# Altium schematic sheet Power.SchDoc
size A
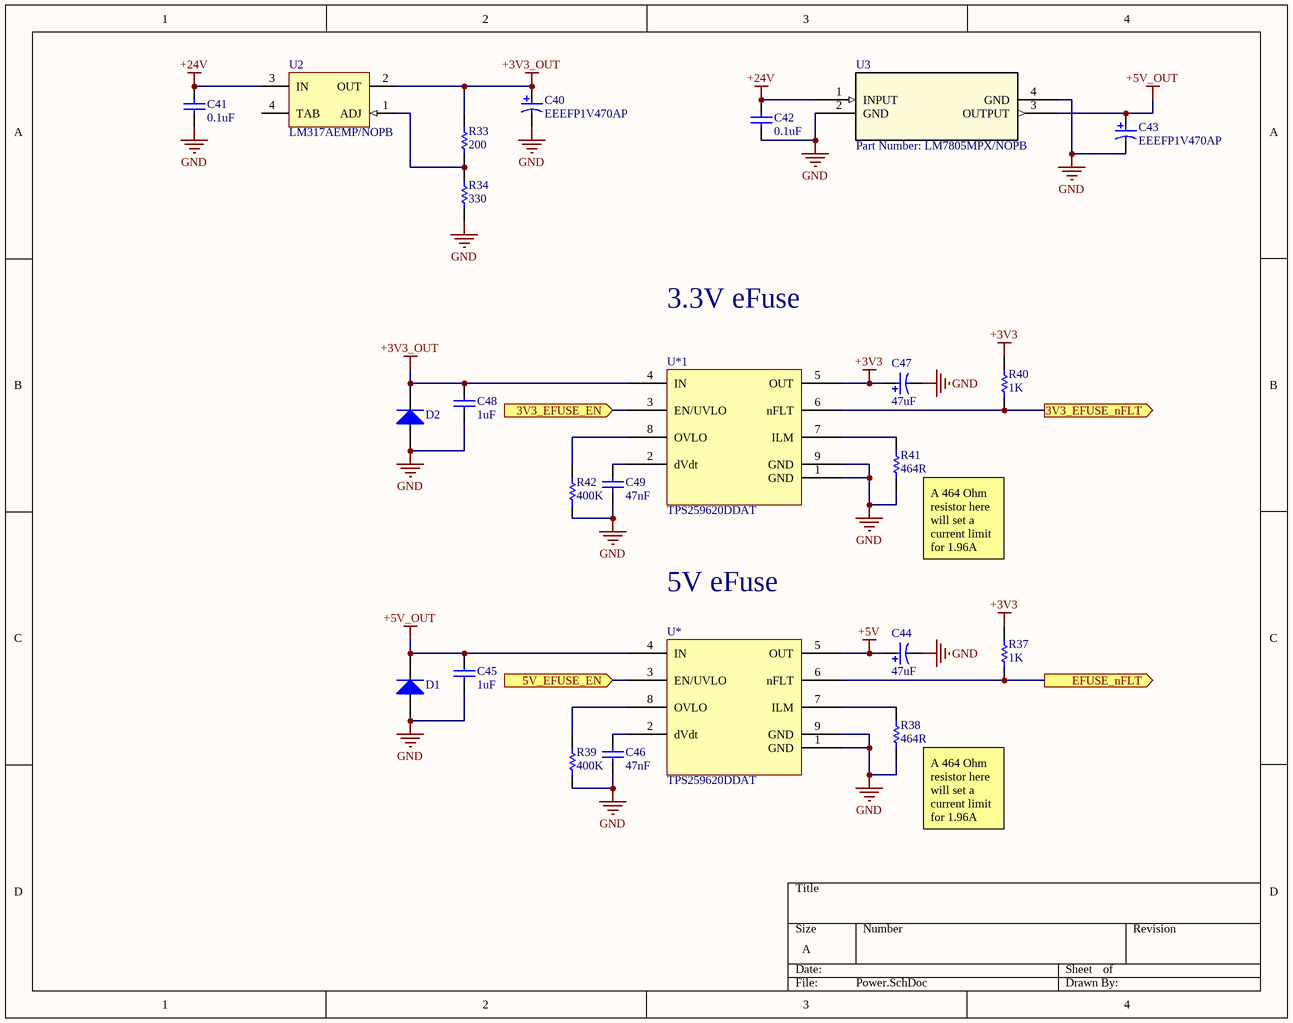
[diagram p0: Power.SchDoc]

## Parts
C40  EEEFP1V470AP  [PNSC-FP-V-D_V]
C41  0.1uF  [CAPC1608X90X35ML10T15]
C42  0.1uF  [CAPC1608X90X35ML10T15]
C43  EEEFP1V470AP  [PNSC-FP-V-D_V]
C44  47uF  [PNSC-FP-V-D_V]
C45  1uF  [CAPC1608X90X20LL10]
C46  47nF  [CAPC1608X90X35ML10T15]
C47  47uF  [PNSC-FP-V-D_V]
C48  1uF  [CAPC1608X90X20LL10]
C49  47nF  [CAPC1608X90X35ML10T15]
D1  SMAJ5.0A-E3/61  [VISH-DO-214AC-2_M]  (value not drawn)
D2  SMAJ5.0A-E3/61  [VISH-DO-214AC-2_M]  (value not drawn)
R33  200  [RESC1608X55X30NL20T20]
R34  330  [RESC1608X55X30NL15T15]
R37  1K  [RESC1608X55X30LL15T15]
R38  464R  [RESC1608X55X30LL15T15]
R39  400K  [RESC1608X55X30LL15T15]
R40  1K  [RESC1608X55X30LL15T15]
R41  464R  [RESC1608X55X30LL15T15]
R42  400K  [RESC1608X55X30LL15T15]
U2  LM317AEMP/NOPB  [DCY0004A_L]
U3  Part Number: LM7805MPX/NOPB  [DCY4]
U*  TPS259620DDAT
U*1  TPS259620DDAT

## Ports
3V3_EFUSE_EN (in), 3V3_EFUSE_nFLT (out), 5V_EFUSE_EN (in), EFUSE_nFLT (out)

## Nets
+3V3: C47.1 R37.2 R40.2 U*1.5(OUT)
+3V3_OUT: C40.1 C48.2 D2.1(K) R33.2 U2.2(OUT) U*1.4(IN)
+5V: C44.1 U*.5(OUT)
+5V_OUT: C43.1 C45.2 D1.1(K) U3.3(OUTPUT) U*.4(IN)
+24V: C41.2 C42.2 U2.3(IN) U3.1(INPUT)
GND: C40.2 C41.1 C42.1 C43.2 C44.2 C45.1 C46.1 C47.2 C48.1 C49.1 D1.2(A) D2.2(A) R34.1 R38.1 R39.1 R41.1 R42.1 U3.2(GND) U3.4(GND) U*.1(GND) U*.9(GND) U*1.1(GND) U*1.9(GND)
3V3_EFUSE_EN: U*1.3(EN/UVLO) ; port 3V3_EFUSE_EN
3V3_EFUSE_nFLT: R40.1 U*1.6(nFLT) ; port 3V3_EFUSE_nFLT
5V_EFUSE_EN: U*.3(EN/UVLO) ; port 5V_EFUSE_EN
EFUSE_nFLT: R37.1 U*.6(nFLT) ; port EFUSE_nFLT
NetC46_2: C46.2 U*.2(dVdt)
NetC49_2: C49.2 U*1.2(dVdt)
NetR33_1: R33.1 R34.2 U2.1(ADJ)
NetR38_2: R38.2 U*.7(ILM)
NetR39_2: R39.2 U*.8(OVLO)
NetR41_2: R41.2 U*1.7(ILM)
NetR42_2: R42.2 U*1.8(OVLO)

Not connected (* = marked no-connect by the designer): U2 4(TAB)

## Notes on the sheet
- 3.3V eFuse
- (near R41) A 464 Ohm resistor here will set a current limit for 1.96A
- 5V eFuse
- (near R38) A 464 Ohm resistor here will set a current limit for 1.96A

## Library data of the parts
C40 C43 C44 C47 = CMP-2000-06216-1: Aluminum Electrolytic Capacitor, 47 uF, +/- 20%, 35 V, 2-Pin SMD (Size Code D), -55 to 105 degC, RoHS, Tape and Reel; Manufacturer: Panasonic; Lifetime@Temperature: 2000Hrs@105°C; Capacitance: 47µF; Type: Can; Rated Voltage: 35V; Ripple Current: 300mA; ESR (Equivalent Series Resistance): 0.26O; Package Reference: FP-V-D; Package Description: 2-Pin Electrolytic Aluminum Capacitor, Body 6.6 x 6.6 mm; Datasheet URL: http://industrial.panasonic.com/cdbs/www-data/pdf/RDE0000/ABA0000C1184.pdf; Series: FP; Operating Temp Range: -55to+105°C; Operating Temp-Max: 105°C; Datasheet Version: 03/2016; Manufacturer URL: http://www.panasonic.com/; Package URL: http://industrial.panasonic.com/cdbs/www-data/pdf/RDE0000/DME0000COL48.pdf; Case Size/Dimension: Ø6.3x5.8mm; Mounting Technology: SurfaceMount
C41 C42 = CMP-2100-03643-1: Chip Capacitor, 0.1 uF, +/- 10%, 50 V, -55 to 125 degC, 0603 (1608 Metric), RoHS, Tape and Reel; Manufacturer: Murata; Dielectric Material: Ceramic; Voltage Rating: 50V; Capacitance: 100nF; Dielectric: X7R; Insulation Resistance: 10GR; Case Code (Metric): 1608; Lead Free: LeadFree; Depth: 0.8mm; Number of Pins: 2; Radiation Hardening: No; Case/Package: 0603; Manufacturer URL: http://www.murata.com/; Packaging: TapeandReel; Length: 1.6mm; Contact Plating: Tin; Datasheet URL: http://psearch.en.murata.com/capacitor/product/GRM188R71H104KA93%23.pdf; Tolerance: 10%; Case Code (Imperial): 0603; Min Operating Temperature: -55degC; RoHSCompliant: true; Voltage: 50V; Termination: SMD/SMT; Mount: SurfaceMount; Material: Ceramic; Package Quantity: 1; Height: 0.8mm; Thickness: 0.035inch; REACH SVHC: NoSVHC; Max Operating Temperature: 125degC; Width: 0.8mm; Package Reference: 0603; Voltage Rating (DC): 50V; Datasheet Version: 42675.0; Package Description: 2-Pin Surface Mount Device, Body 1.6 x 0.8 mm
C45 C48 = CMP-2000-06025-1: Chip Capacitor, 1 uF, +/- 10%, 50 V, -55 to 85 degC, 0603 (1608 Metric), RoHS, Tape and Reel; Manufacturer: TDK; PCN Part Number: MLCCPartNumberChange30/Nov/2012; Other Names: 445-7468-6; Online Catalog: CSeries,GeneralPurpose; Capacitance: 1µF; Product Training Modules: CSeriesGeneralApplicationsSEAT,CCV,andTVCLDesignToolsGuidetoReplacinganElectrolyticCapacitorwithanMLCC; Voltage - Rated: 50V; Design Resources: 20WNon-IsolatedBuckLEDDriverUsingPLLNK460KG; Temperature Coefficient: X5R; Series: C; Datasheet Version: 08/2016; Package Description: 2-Pin Surface Mount Device, Body 1.6 x 0.8 mm; Mounting Technology: SurfaceMount; Features: -; Size / Dimension: 0.063"Lx0.031"W(1.60mmx0.80mm); Lead Spacing: -; Operating Temperature: -55°C~85°C; Tolerance: ±10%; Height - Seated (Max): -; Mounting Type: SurfaceMount,MLCC; Ratings: -; Standard Package: 1; Applications: GeneralPurpose; Datasheet URL: https://product.tdk.com/info/en/catalog/datasheets/mlcc_commercial_general_en.pdf; Category: Capacitors; Lead Style: -; Packaging: Digi-Reel®; RoHS Information: RoHSCertificate-MLCC; Package / Case: 0603(1608Metric); Package Reference: 0603; Manufacturer URL: http://www.tdk.com/; Thickness (Max): 0.035"(0.90mm); Family: CeramicCapacitors
C46 C49 = CMP-2006-02927-1: Manufacturer: Murata; Part Number: GRM188R71H473KA61D
D1 D2 = CMP-0548-00235-2: Transient Voltage Suppressor, 6.40 to 231 V, 5 V Stand-off Voltage, Uni-Directional, -55 to 155 degC, 2-pin DO-214AC, Pb-Free, Tape and Reel; Manufacturer: Vishay Semiconductor; ID (uA): 800; VBR Uni-Directional (V): 6.4 to 231; IFSM: 40 A; PPPM (W): 400, 300; VWM (V): 5; PackageReference: DO-214AC-2; ComponentLink2URL: http://www.vishay.com/docs/88390/smaj50a.pdf; Operating Junction and Storage Temperature Range: -55 to 150 degC; ComponentLink1Description: Manufacturer URL; PackageDescription: 2-Pin DO-214AC (SMA), Body 4.245 x 2.665 mm; ComponentLink2Description: Datasheet; ComponentLink3URL: http://www.vishay.com/docs/88390/smaj50a.pdf; ComponentLink3Description: Package Specification; RoHS: TRUE; PartNumber: SMAJ5.0A-E3/61; Mounting Technology: Surface Mount; ComponentLink1URL: http://www.vishay.com/; Packing: Tape and Reel; DatasheetVersion: 12/8/2013
R33 = CMP-2000-00944-1: Manufacturer: Panasonic; Part Number: ERA3AEB201V
R34 = CMP-2000-00435-1: Part Number: ERJ3EKF3300V; Manufacturer: Panasonic
R37-R42 = CMP-2000-00411-1: Manufacturer: Panasonic; Part Number: ERJ-3EKF3000V
U2 = CMP-0062-01710-3: 3-Terminal Adjustable Regulator, 4-pin SOT-223, Pb-Free; Manufacturer: Texas Instruments; PowerWise: N; CompType: LDO IC; PackageTopMarking: XYTT*N07A; PackageDescription: Molded SOT-223, 6.50 x 3.56 x 1.6mm Body, 4 Lead, 2.3mm Pitch; Code_JEDEC: TO-261-AA; RoHS: Y; ComponentLink1URL: http://www.ti.com/general/docs/lit/getliterature.tsp?genericPartNumber=LM317-N&fileType=pdf; PackageReference: DCY0004A; ComponentLink1Description: Datasheet URL; Code_IPC: SOT223-4; PinCount: 4
U3 = LM7805MPX/NOPB: No Description Available; Vendor: Texas Instruments; Built_By: EMA_Jessica; Manufacturer_Part_Number: LM7805MPX/NOPB; Copyright: Copyright (C) 2018 Accelerated Designs. All rights reserved; RefDes: RefDes; Type: DEV; Value: Value